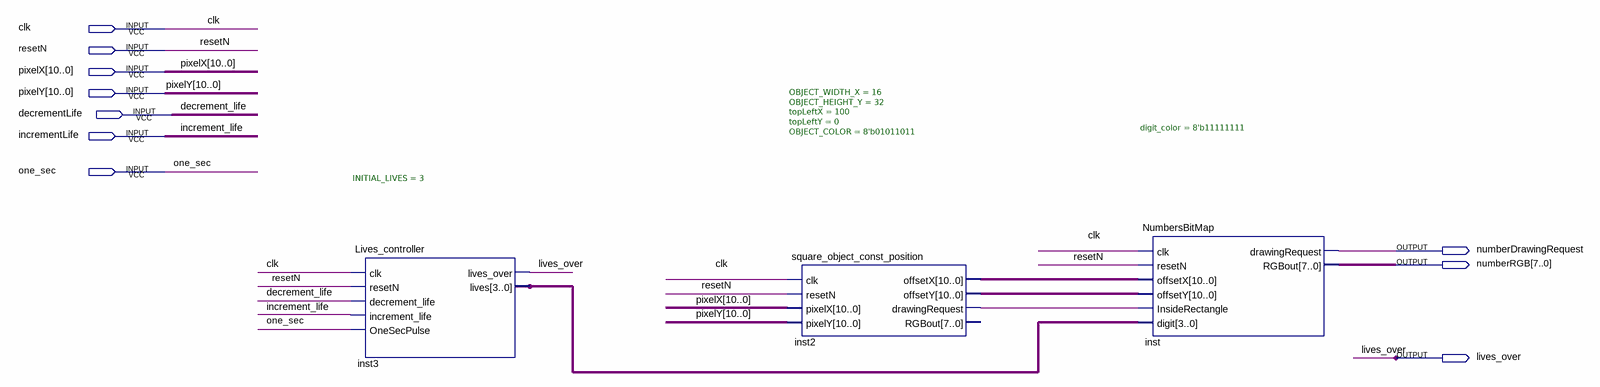
[diagram p0: schematic sheet]
// Quartus schematic LIVES_NUM_DISPLAY.bdf as structural Verilog: 3 symbols, 10 pins
module LIVES_NUM_DISPLAY (
  input  clk,
  input  resetN,
  input  [10:0] pixelX,
  input  [10:0] pixelY,
  input  decrementLife,
  input  incrementLife,
  input  one_sec,
  output numberDrawingRequest,
  output [7:0] numberRGB,
  output lives_over
);

  wire inst2_drawingrequest;
  wire [3:0] inst3_lives;
  wire [10:0] inst2_offsetx, inst2_offsety;

  Lives_controller #(.INITIAL_LIVES(3)) inst3 (
    .clk(clk), .resetN(resetN), .decrement_life(decrementLife), .increment_life(incrementLife),
    .OneSecPulse(one_sec), .lives_over(lives_over), .lives(inst3_lives));
  square_object_const_position #(.OBJECT_WIDTH_X(16), .OBJECT_HEIGHT_Y(32), .topLeftX(100), .topLeftY(0), .OBJECT_COLOR(8'b01011011)) inst2 (
    .clk(clk), .resetN(resetN), .pixelX(pixelX), .pixelY(pixelY), .offsetX(inst2_offsetx),
    .offsetY(inst2_offsety), .drawingRequest(inst2_drawingrequest));  // open: RGBout
  NumbersBitMap #(.digit_color(8'b11111111)) inst (
    .clk(clk), .resetN(resetN), .offsetX(inst2_offsetx), .offsetY(inst2_offsety),
    .InsideRectangle(inst2_drawingrequest), .digit(inst3_lives), .drawingRequest(numberDrawingRequest),
    .RGBout(numberRGB));

  // Other names for the same wires on the sheet: decrement_life = decrementLife; increment_life = incrementLife
endmodule
